# EAGLE design ScoreBoard-0.2 (EAGLE 9.5.1)
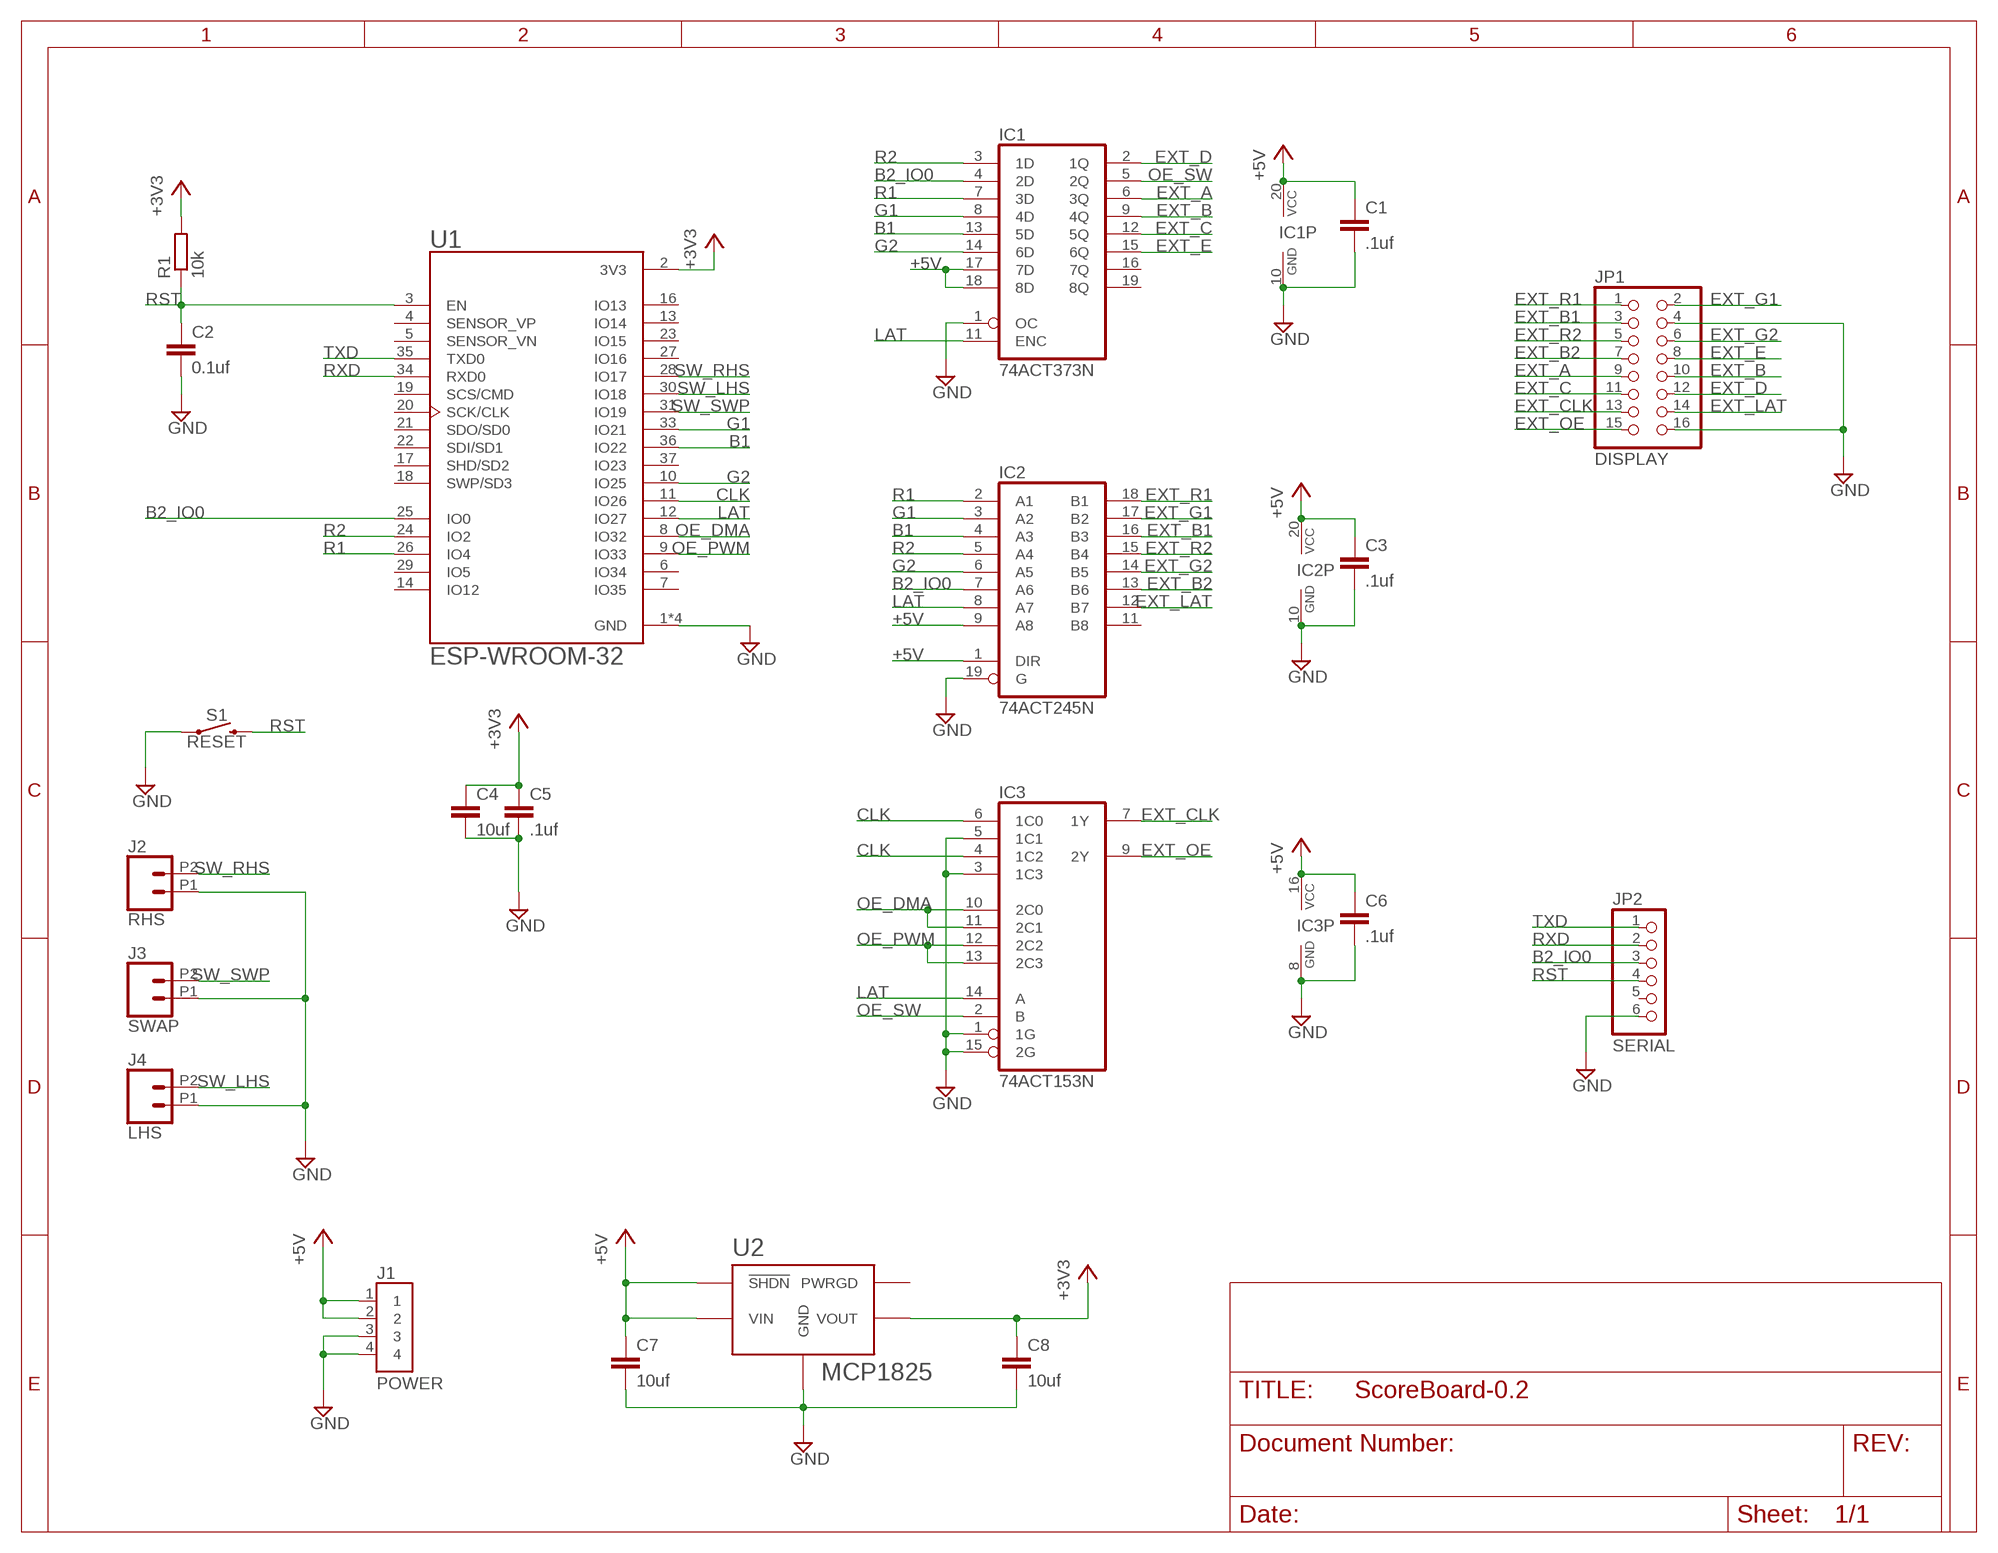
[diagram p0: schematic, sheet 1]

## Parts
C1  .1uf  C-EU025-025X050  [C025-025X050]
C2  0.1uf  C-EU025-025X050  [C025-025X050]
C3  .1uf  C-EU025-025X050  [C025-025X050]
C4  10uf  C-EU050-025X075  [C050-025X075]
C5  .1uf  C-EU025-025X050  [C025-025X050]
C6  .1uf  C-EU025-025X050  [C025-025X050]
C7  10uf  C-EU050-025X075  [C050-025X075]
C8  10uf  C-EU050-025X075  [C050-025X075]
IC1  74ACT373N  [DIL20]
IC2  74ACT245N  [DIL20]
IC3  74ACT153N  [DIL16]
J1  POWER  1-1123723-4  [TE_1-1123723-4]
J2  RHS  CONN_022.54MM_SCREWTERM  [1X02_2.54_SCREWTERM]
J3  SWAP  CONN_022.54MM_SCREWTERM  [1X02_2.54_SCREWTERM]
J4  LHS  CONN_022.54MM_SCREWTERM  [1X02_2.54_SCREWTERM]
JP1  DISPLAY  PINHD-2X8  [2X08]
JP2  SERIAL  PINHD-1X6/90  [1X06/90]
R1  10k  R-EU_0204/7  [0204/7]
S1  RESET  MOMENTARY-SWITCH-SPST-PTH-6.0MM  [TACTILE_SWITCH_PTH_6.0MM]
U1  ESP-WROOM-32  [MODULE_ESP-WROOM-32]
U2  MCP1825  MCP1825/DC  [SOT-223-5]

## Nets
+3V3 [power]: C4.1 C5.1 C8.1 R1.2 U1.2(3V3) U2.P$4(VOUT)
+5V [power]: C1.1 C3.1 C6.1 C7.1 IC1.17(7D) IC1.18(8D) IC1.20(VCC) IC2.1(DIR) IC2.9(A8) IC2.20(VCC) IC3.16(VCC) J1.1 J1.2 U2.P$1(!SHDN) U2.P$2(VIN)
B1: IC1.13(5D) IC2.4(A3) U1.36(IO22)
B2_IO0: IC1.4(2D) IC2.7(A6) JP2.3 U1.25(IO0)
CLK: IC3.4(1C2) IC3.6(1C0) U1.11(IO26)
EXT_A: IC1.6(3Q) JP1.9
EXT_B: IC1.9(4Q) JP1.10
EXT_B1: IC2.16(B3) JP1.3
EXT_B2: IC2.13(B6) JP1.7
EXT_C: IC1.12(5Q) JP1.11
EXT_CLK: IC3.7(1Y) JP1.13
EXT_D: IC1.2(1Q) JP1.12
EXT_E: IC1.15(6Q) JP1.8
EXT_G1: IC2.17(B2) JP1.2
EXT_G2: IC2.14(B5) JP1.6
EXT_LAT: IC2.12(B7) JP1.14
EXT_OE: IC3.9(2Y) JP1.15
EXT_R1: IC2.18(B1) JP1.1
EXT_R2: IC2.15(B4) JP1.5
G1: IC1.8(4D) IC2.3(A2) U1.33(IO21)
G2: IC1.14(6D) IC2.6(A5) U1.10(IO25)
GND [power]: C1.2 C2.2 C3.2 C4.2 C5.2 C6.2 C7.2 C8.2 IC1.1(OC) IC1.10(GND) IC2.10(GND) IC2.19(G) IC3.1(1G) IC3.3(1C3) IC3.5(1C1) IC3.8(GND) IC3.15(2G) J1.3 J1.4 J2.P1 J3.P1 J4.P1 JP1.4 JP1.16 JP2.6 S1.1 U1.1(GND) U1.1.1(GND) U1.15(GND) U1.38(GND) U2.P$3(GND) U2.P$6(GND)
LAT: IC1.11(ENC) IC2.8(A7) IC3.14(A) U1.12(IO27)
OE_DMA: IC3.10(2C0) IC3.11(2C1) U1.8(IO32)
OE_PWM: IC3.12(2C2) IC3.13(2C3) U1.9(IO33)
OE_SW: IC1.5(2Q) IC3.2(B)
R1: IC1.7(3D) IC2.2(A1) U1.26(IO4)
R2: IC1.3(1D) IC2.5(A4) U1.24(IO2)
RST: C2.1 JP2.4 R1.1 S1.3 U1.3(EN)
RXD: JP2.2 U1.34(RXD0)
SW_LHS: J4.P2 U1.30(IO18)
SW_RHS: J2.P2 U1.28(IO17)
SW_SWP: J3.P2 U1.31(IO19)
TXD: JP2.1 U1.35(TXD0)
Unconnected: IC1.16(7Q) IC1.19(8Q) IC2.11(B8) JP2.5 U1.4(SENSOR_VP) U1.5(SENSOR_VN) U1.6(IO34) U1.7(IO35) U1.13(IO14) U1.14(IO12) U1.16(IO13) U1.17(SHD/SD2) U1.18(SWP/SD3) U1.19(SCS/CMD) U1.20(SCK/CLK) U1.21(SDO/SD0) U1.22(SDI/SD1) U1.23(IO15) U1.27(IO16) U1.29(IO5) U1.37(IO23) U2.P$5(PWRGD)

## Library data of the parts
C1-C8 = rcl:C-EU: CAPACITOR, European symbol; SPICEPREFIX: C
IC1 = 74xx-eu:74*373: Octal D type transparent LATCH, edge triggered
IC2 = 74xx-eu:74*245: Octal BUS TRANSCEIVER, 3-state
IC3 = 74xx-eu:74*153: Dual 4-line to 1-line data SELECTOR/MULTIPLEXER
J1 = 1-1123723-4:1-1123723-4: Conn Wire to Board HDR 4 POS 3.96mm Solder ST Thru-Hole Automotive Bag; CENTERLINE_PITCH: 3.96 mm[.156 in]; COMMENT: 1-1123723-4; DESCRIPTION: 3.96 EP HDR ASSY 4P_NATURAL_; DIGI-KEY_PART_NUMBER: A106863-ND; DIGI-KEY_PURCHASE_URL: https://www.digikey.com/product-detail/en/te-connectivity-amp-connectors/1-1123723-4/A106863-ND/686927?utm_source=snapeda&utm_medium=aggregator&utm_campaign=symbol; EU_ROHS_COMPLIANCE: Compliant; MF: TE Connectivity; MP: 1-1123723-4; NUMBER_OF_POSITIONS: 4; PACKAGE: None; PRODUCT_TYPE: Header; TE_PURCHASE_URL: https://www.te.com/usa-en/product-1-1123723-4.html?te_bu=Cor&te_type=disp&te_campaign=seda_glo_cor-seda-global-disp-prtnr-fy19-seda-model-bom-cta_sma-317_1&elqCampaignId=32493
J2-J4 = SparkFun-Connectors:CONN_02: Multi connection point. Often used as Generic Header-pin footprint for 0.1 inch spaced/style header connections On any of the 0.1 inch spaced packages, you can populate with these: Break Away Headers - Straight <https://www.sparkfun.com/products/116> (PRT-00116) Break Away Male Headers - Right Angle <https://www.sparkfun.com/products/553> (PRT-00553) Female Headers <https://www.sparkfun.com/products/115> (PRT-00115) Break Away Headers - Machine Pin <https://www.sparkfun.com/products/117> (PRT-00117) Break Away Female Headers - Swiss Machine Pin <https://www.sparkfun.com/products/743> (PRT-00743) For SCREWTERMINALS and SPRING TERMINALS visit here: Screw Terimnals on SparkFun.com <https://www.sparkfun.com/search/results?term=Screw+Terminals> (5mm/3.5mm/2.54mm spacing) This device is also useful as a general connection point to wire up your design to another part of your project. Our various solder wires solder well into these plated through hole pads. Hook-Up Wire - Assortment (Stranded, 22 AWG) <https://www.sparkfun.com/products/11375> (PRT-11375) Hook-Up Wire - Assortment (Solid Core, 22 AWG) <https://www.sparkfun.com/products/11367> (PRT-11367) View the entire wire category on our website here <https://www.sparkfun.com/categories/141> Special notes: Molex polarized connector foot print use with: PRT-08233 with associated crimp pins and housings. 2.54_SCREWTERM for use with PRT-10571. 3.5mm Screw Terminal footprints for PRT-08084 5mm Screw Terminal footprints for use with PRT-08432
JP1 = pinhead:PINHD-2X8: PIN HEADER
JP2 = pinhead:PINHD-1X6: PIN HEADER
R1 = rcl:R-EU_: RESISTOR, European symbol; SPICEPREFIX: R
S1 = SparkFun-Switches:MOMENTARY-SWITCH-SPST: Momentary Switch (Pushbutton) - SPST Normally-open (NO) SPST momentary switches (buttons, pushbuttons). Variants PTH-12MM - 12mm square, through-hole Momentary Pushbutton Switch - 12mm Square <https://www.sparkfun.com/products/9190> (COM-09190) PTH-6.0MM, PTH-6.0MM-KIT - 6.0mm square, through-hole Mini Pushbutton Switch <https://www.sparkfun.com/products/97> (COM-00097) KIT package intended for soldering kit's - only one side of pads' copper is exposed. PTH-RIGHT-ANGLE-KIT - Right-angle, through-hole Right Angle Tactile Button <https://www.sparkfun.com/products/10791> - Used on SparkFun BigTime Watch Kit <https://www.sparkfun.com/products/11734> SMD-12MM - 12mm square, surface-mount Tactile Button - SMD (12mm) <https://www.sparkfun.com/products/12993> (COM-12993) Used on SparkFun PicoBoard <https://www.sparkfun.com/products/11888> SMD-4.5MM - 4.5mm Square Trackball Switch Used on SparkFun Blackberry Trackballer Breakout <https://www.sparkfun.com/products/13169> SMD-4.6MMX2.8MM - 4.60mm x 2.80mm, surface mount Used on SparkFun SAMD21 Mini Breakout <https://www.sparkfun.com/products/13664> SMD-5.2MM, SMD-5.2-REDUNDANT - 5.2mm square, surface-mount Mini Pushbutton Switch - SMD <https://www.sparkfun.com/products/8720> (COM-08720) Used on Arduino Pro Mini <https://www.sparkfun.com/products/11114> REDUNDANT package connects both switch circuits together SMD-6.0X3.5MM - 6.0 x 3.5mm, surface mount Momentary Reset Switch SMD <https://www.sparkfun.com/products/8229> (COM-08229) SMD-6.2MM-TALL - 6.2mm square, surface mount Tactile Button - SMD (6mm) <https://www.sparkfun.com/products/12992> Used on SparkFun Digital Sandbox <https://www.sparkfun.com/products/12651> SMD-RIGHT-ANGLE - Right-angle, surface mount Used on SparkFun Block for Intel® Edison - Arduino <https://www.sparkfun.com/products/13036>; PROD_ID: SWCH-08441; SF_SKU: COM-00097
U1 = ESP-WROOM-32:ESP-WROOM-32: Module: combo; GPIO, I2C x2, I2S x2, SDIO, SPI x3, UART x3; 19.5dBm; DESCRIPTION: Module: combo; GPIO, I2C x2, I2S x2, SDIO, SPI x3, UART x3; 19.5dBm; DIGI-KEY_PART_NUMBER: 1188-1178-ND; DIGI-KEY_PURCHASE_URL: https://www.digikey.com/product-detail/en/olimex-ltd/ESP-WROOM-32/1188-1178-ND/6580750?utm_source=snapeda&utm_medium=aggregator&utm_campaign=symbol; MF: Olimex LTD; MP: ESP-WROOM-32; PACKAGE: Module Espressif Systems
U2 = voltagereg:MCP1825/DC

## Net classes
1 power: width 0.635 mm, clearance 0.254 mm to class 0, clearance 0.254 mm

## Board
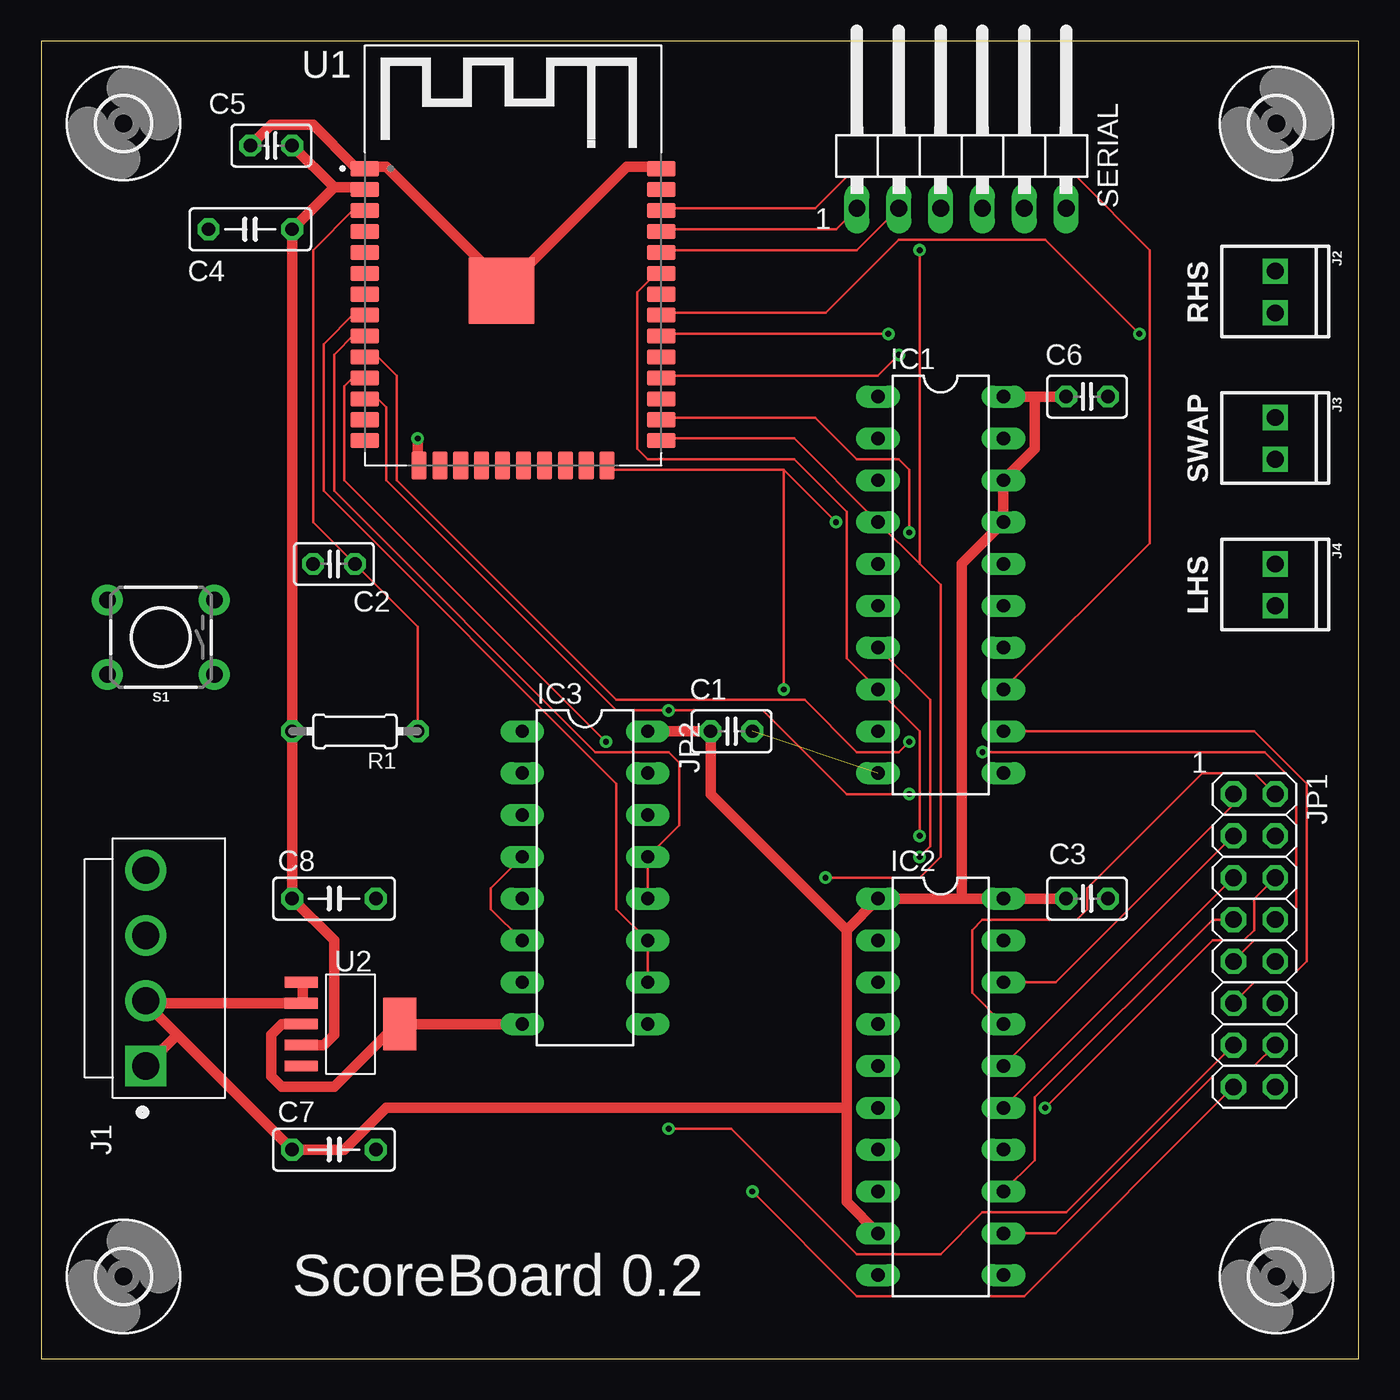
[diagram p1: board, top side]
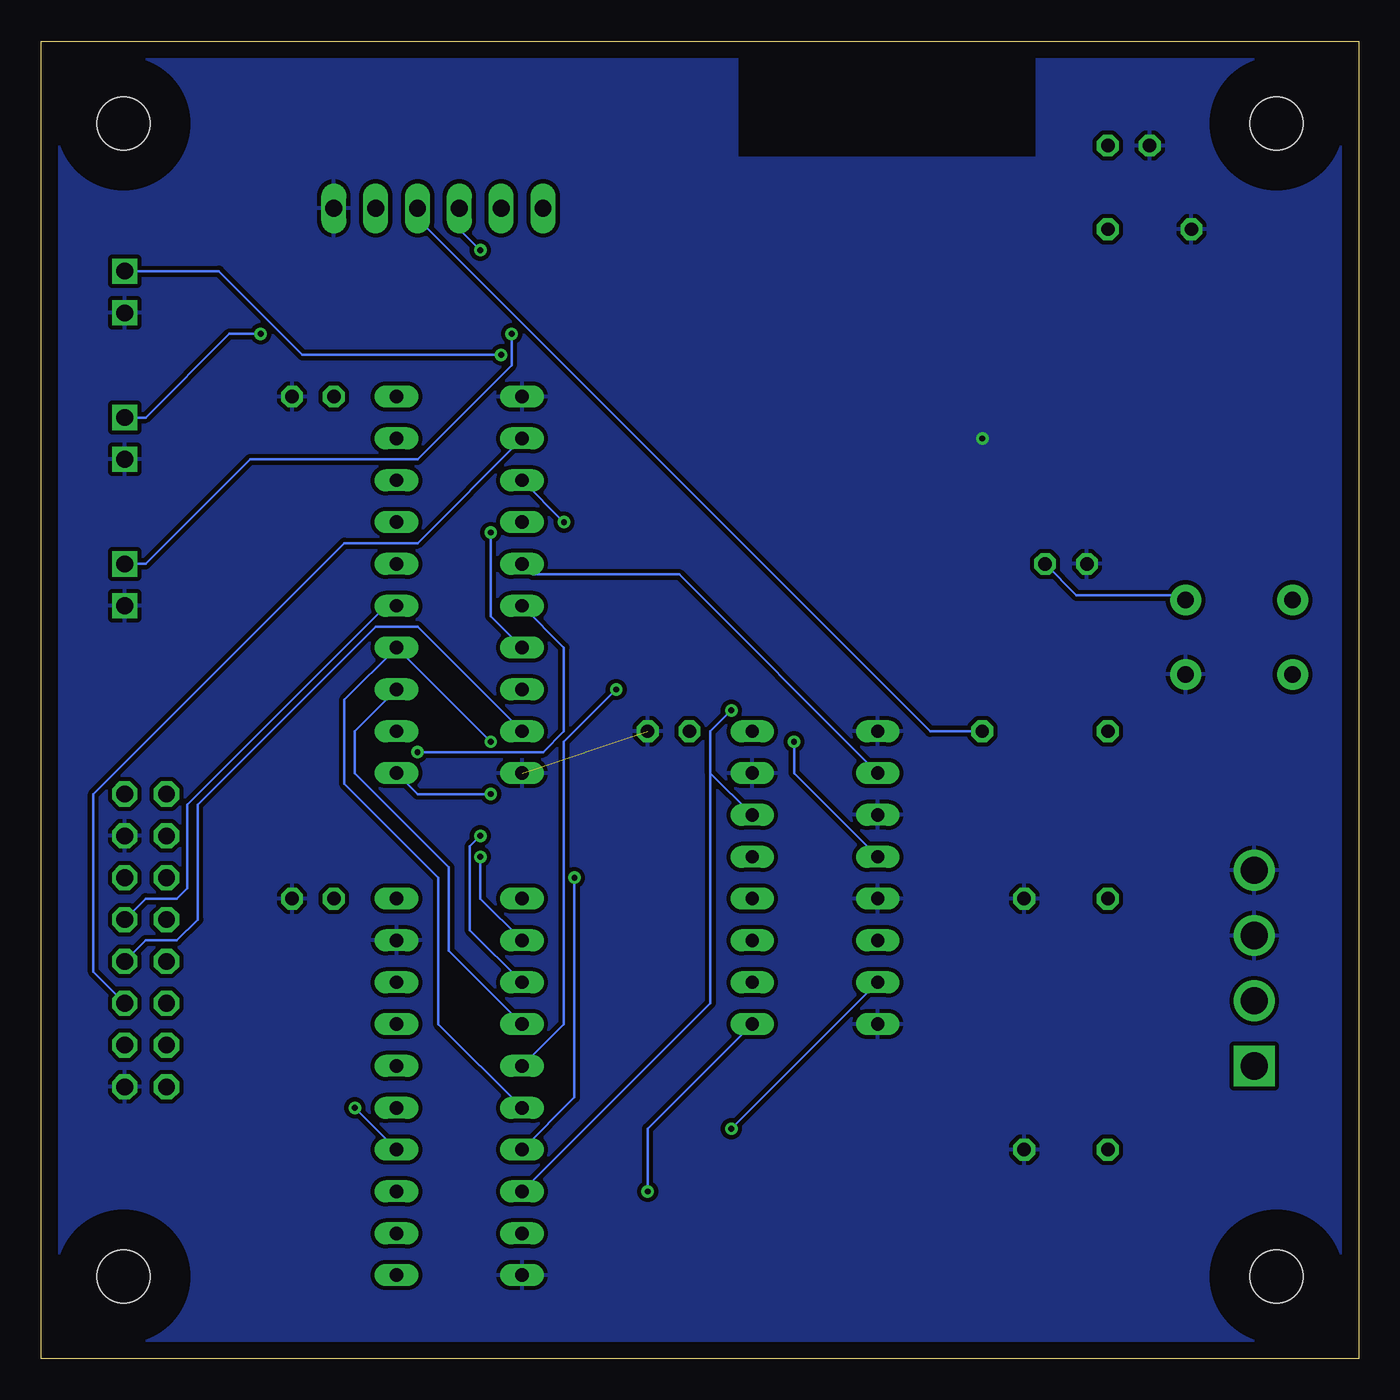
[diagram p2: board, bottom side, seen from below]

Size 80 x 80 mm. Coordinates in mm from the lower left corner, seen from the top.
Outline: 0,0 80,0 80,80 0,80 0,0
Copper layers (1*16): Top 0.035mm / dielectric 0.15mm / Bottom 0.035mm
Design rules "default": minimum track width 6mil, minimum drill 0.35mm, track to track 6mil, track to pad 6mil, pad to pad 6mil, via to via 6mil, smd to smd 6mil, copper to edge 40mil, drill to drill 6mil, minimum pad ring 10mil, minimum via ring 8mil, stop-mask expansion 4mil, vias tented up to drill 0mil, thermal gap 10mil

### Footprints (pad centres in the part's own frame; a part is rotated, then mirrored left to right if it is on the bottom)
C025-025X050 = drill 0.813 octagon: 1 -1.27,0; 2 1.27,0
C050-025X075 = drill 0.813 octagon: 1 -2.54,0; 2 2.54,0
DIL20 = drill 0.813 long: 1 -11.43,-3.81; 2 -8.89,-3.81; 3 -6.35,-3.81; 4 -3.81,-3.81; 5 -1.27,-3.81; 6 1.27,-3.81; 7 3.81,-3.81; 8 6.35,-3.81; 9 8.89,-3.81; 10 11.43,-3.81; 11 11.43,3.81; 12 8.89,3.81; 13 6.35,3.81; 14 3.81,3.81; 15 1.27,3.81; 16 -1.27,3.81; 17 -3.81,3.81; 18 -6.35,3.81; 19 -8.89,3.81; 20 -11.43,3.81
DIL16 = drill 0.813 long: 1 -8.89,-3.81; 2 -6.35,-3.81; 3 -3.81,-3.81; 4 -1.27,-3.81; 5 1.27,-3.81; 6 3.81,-3.81; 7 6.35,-3.81; 8 8.89,-3.81; 9 8.89,3.81; 10 6.35,3.81; 11 3.81,3.81; 12 1.27,3.81; 13 -1.27,3.81; 14 -3.81,3.81; 15 -6.35,3.81; 16 -8.89,3.81
TE_1-1123723-4 = drill 1.65 square: 1 0,0 | drill 1.65: 2 3.96,0; 3 7.92,0; 4 11.88,0
1X02_2.54_SCREWTERM = drill 1.016 square: P1 2.54,0; P2 0,0
2X08 = drill 1.016 octagon: 1 -8.89,-1.27; 2 -8.89,1.27; 3 -6.35,-1.27; 4 -6.35,1.27; 5 -3.81,-1.27; 6 -3.81,1.27; 7 -1.27,-1.27; 8 -1.27,1.27; 9 1.27,-1.27; 10 1.27,1.27; 11 3.81,-1.27; 12 3.81,1.27; 13 6.35,-1.27; 14 6.35,1.27; 15 8.89,-1.27; 16 8.89,1.27
1X06/90 = drill 1.016 long: 1 -6.35,-3.81; 2 -3.81,-3.81; 3 -1.27,-3.81; 4 1.27,-3.81; 5 3.81,-3.81; 6 6.35,-3.81
0204/7 = drill 0.813 octagon: 1 -3.81,0; 2 3.81,0
TACTILE_SWITCH_PTH_6.0MM = drill 1.016 pad 1.88: 1 -3.251,2.261; 2 3.251,2.261; 3 -3.251,-2.261; 4 3.251,-2.261
MODULE_ESP-WROOM-32 = smd 1.7 x 0.9: 1 -9,8.255; 2 -9,6.985; 3 -9,5.715; 4 -9,4.445; 5 -9,3.175; 6 -9,1.905; 7 -9,0.635; 8 -9,-0.635; 9 -9,-1.905; 10 -9,-3.175; 11 -9,-4.445; 12 -9,-5.715; 13 -9,-6.985; 14 -9,-8.255; 25 9,-8.255; 26 9,-6.985; 27 9,-5.715; 28 9,-4.445; 29 9,-3.175; 30 9,-1.905; 31 9,-0.635; 32 9,0.635; 33 9,1.905; 34 9,3.175; 35 9,4.445; 36 9,5.715; 37 9,6.985; 38 9,8.255 | smd 4 x 4: 1.1 -0.7,0.845 | smd 0.9 x 1.7: 15 -5.715,-9.755; 16 -4.445,-9.755; 17 -3.175,-9.755; 18 -1.905,-9.755; 19 -0.635,-9.755; 20 0.635,-9.755; 21 1.905,-9.755; 22 3.175,-9.755; 23 4.445,-9.755; 24 5.715,-9.755
SOT-223-5 = smd 0.65 x 2: P$1 -2.54,-2; P$2 -1.27,-2; P$3 0,-2; P$4 1.27,-2; P$5 2.54,-2 | smd 3.2 x 2: P$6 0,4
3,2 = hole 3.2: 0,0

### Placement (x,y rotation side)
C1  41.91,38.1 0 top
C2  17.78,48.26 180 top
C3  63.5,27.94 0 top
C4  12.7,68.58 180 top
C5  13.97,73.66 180 top
C6  63.5,58.42 0 top
C7  17.78,12.7 0 top
C8  17.78,27.94 0 top
IC1  54.61,46.99 270 top
IC2  54.61,16.51 270 top
IC3  33.02,29.21 270 top
J1  6.35,17.78 90 top
J2  74.93,66.04 270 top
J3  74.93,57.15 270 top
J4  74.93,48.26 270 top
JP1  73.66,25.4 270 top
JP2  55.88,73.66 0 top
R1  19.05,38.1 180 top
S1  7.27,43.81 180 top
U1  28.65,64 0 top
U2  17.78,20.32 270 top
U$1  [3,2]  5,75 0 top
U$2  [3,2]  5,5 0 top
U$3  [3,2]  75,5 0 top
U$4  [3,2]  75,75 0 top

### Tracks (layer width: path | path; a pad name or v marks a point on that pad's centre or on a via)
+3V3
  Top 0.635: 17.78,71.12 19.05,71.12 U1.2 | C5.1 17.78,71.12 | 17.78,71.12 C4.1 R1.2 C8.1 17.78,25.4 17.78,19.68 17.14,19.05 U2.P$4
+5V
  Top 0.635: U2.P$1 15.88,22.86 15.88,21.59 U2.P$2 6.35,21.59 | 6.35,21.59 8.26,19.68 | 8.26,19.68 C7.1 18.41,12.7 20.95,15.24 48.9,15.24 | 6.35,21.59 J1.2 | 8.26,19.68 J1.1 | C6.1 60.33,58.42 | 60.33,58.42 IC1.20 | 60.33,58.42 60.33,55.24 IC1.18 IC1.17 55.88,48.26 55.88,27.94 | C3.1 IC2.20 55.88,27.94 | IC3.16 C1.1 40.64,34.29 48.9,26.04 | IC2.9 48.9,9.53 48.9,15.24 | 48.9,26.04 48.9,15.24 | 48.9,26.04 IC2.1 55.88,27.94
B1
  Top 0.152: IC1.13 67.31,49.53 67.31,67.31 62.87,71.75 48.9,71.75 46.99,69.85 38.1,69.85 U1.36
  Bottom 0.152: IC2.4 55.24,24.77 55.24,29.84 60.96,35.56 60.96,38.1 IC1.13
B2_IO0  (via drill 0.35)
  Top 0.152: U1.25 38.1,55.88 45.72,55.88 IC1.4 53.34,48.26 | v47.62,29.21 53.34,29.21 54.61,30.48 54.61,46.99 53.34,48.26 | 53.34,48.26 v53.34,67.31
  Bottom 0.152: IC2.7 47.62,15.88 v47.62,29.21 | JP2.3 54.61,68.58 v53.34,67.31
CLK  (via drill 0.35)
  Top 0.152: v34.29,37.47 18.41,53.34 18.41,59.05 19.05,59.69 U1.11 | IC3.6 27.3,27.3 27.3,28.57 IC3.4
  Bottom 0.152: v34.29,37.47 34.29,35.56 IC3.4
EXT_A  (via drill 0.35)
  Top 0.152: v57.15,36.83 74.3,36.83 76.2,34.92 76.2,26.04 75.56,25.4 73.66,25.4 JP1.9
  Bottom 0.152: IC1.6 48.26,43.18 48.26,38.1 49.53,36.83 v57.15,36.83
EXT_B
  Bottom 0.152: IC1.9 57.15,44.45 59.69,44.45 70.48,33.66 70.48,26.67 71.75,25.4 73.66,25.4 JP1.10
EXT_B1
  Top 0.152: JP1.3 IC2.16
EXT_B2
  Top 0.152: IC2.13 60.33,12.06 60.33,15.88 71.12,26.67 JP1.7
EXT_C
  Top 0.152: IC1.12 73.66,38.1 76.83,34.92 76.83,24.13 75.56,22.86 73.66,22.86 JP1.11
EXT_CLK  (via drill 0.35)
  Top 0.152: v38.1,13.97 41.91,13.97 49.53,6.35 54.61,6.35 57.15,8.89 62.23,8.89 JP1.13
  Bottom 0.152: v38.1,13.97 IC3.7
EXT_D
  Bottom 0.152: IC1.2 57.15,49.53 61.59,49.53 76.83,34.29 76.83,23.5 JP1.12
EXT_E
  Bottom 0.152: IC1.15 59.05,45.72 71.12,33.66 71.12,28.57 71.75,27.94 73.66,27.94 JP1.8
EXT_G1
  Top 0.152: IC2.17 56.52,22.23 56.52,26.04 57.15,26.67 62.87,26.67 63.5,27.3 63.5,28.57 70.48,35.56 73.66,35.56 JP1.2
EXT_G2  (via drill 0.35)
  Top 0.152: v60.96,15.24 71.12,25.4 73.03,25.4 73.66,26.04 73.66,27.94 JP1.6
  Bottom 0.152: v60.96,15.24 IC2.14
EXT_LAT
  Top 0.152: IC2.12 61.59,7.62 71.75,17.78 73.66,17.78 JP1.14
EXT_OE  (via drill 0.35)
  Top 0.152: v43.18,10.16 49.53,3.81 59.69,3.81 JP1.15
  Bottom 0.152: IC3.9 43.18,13.97 v43.18,10.16
EXT_R1
  Top 0.152: IC2.18 61.59,22.86 72.39,33.66 JP1.1
EXT_R2
  Top 0.152: JP1.5 IC2.15
G1  (via drill 0.35)
  Top 0.152: U1.33 37.47,66.04 36.2,64.77 36.2,55.24 36.83,54.61 45.72,54.61 48.9,51.44 48.9,42.55 IC1.8 53.34,38.1 v53.34,31.75
  Bottom 0.152: IC2.3 53.98,26.04 53.98,31.11 v53.34,31.75
G2  (via drill 0.35)
  Top 0.152: v52.7,37.47 52.07,36.83 49.53,36.83 46.35,40.01 34.92,40.01 21.59,53.34 21.59,59.69 20.32,60.96 19.68,60.96 U1.10
  Bottom 0.152: v52.7,37.47 IC1.14 61.59,40.01 61.59,34.92 55.88,29.21 55.88,20.32 IC2.6
GND  (via drill 0.35)  (1 unrouted)
  Top 0.635: U1.38 37.47,72.39 35.56,72.39 28.57,65.41 U1.1.1 27.94,65.41 20.95,72.39 19.68,72.39 U1.1 19.05,72.39 16.51,74.93 13.97,74.93 C5.2 | U2.P$3 14.61,20.32 13.97,19.68 13.97,17.14 14.61,16.51 17.78,16.51 21.59,20.32 U2.P$6 IC3.8 | v22.86,55.88 22.86,54.61 U1.15
  pour Bottom: 0,80 80,80 80,0 0,0
LAT  (via drill 0.35)
  Top 0.152: U1.12 19.68,58.42 20.32,58.42 20.95,57.78 20.95,53.34 34.92,39.37 v38.1,39.37 43.81,39.37 48.9,34.29 v52.7,34.29
  Bottom 0.152: v38.1,39.37 39.37,38.1 39.37,35.56 | IC3.14 39.37,35.56 | IC2.8 39.37,21.59 39.37,35.56 | IC1.11 57.15,34.29 v52.7,34.29
OE_DMA
  Top 0.152: U1.8 19.05,63.5 17.14,61.59 17.14,52.7 34.92,34.92 34.92,27.3 IC3.11 IC3.10
OE_PWM
  Top 0.152: U1.9 19.05,62.23 17.78,60.96 17.78,52.7 33.66,36.83 38.1,36.83 38.73,36.2 38.73,32.38 IC3.13 IC3.12
OE_SW
  Bottom 0.152: IC3.2 41.27,47.62 50.16,47.62 IC1.5
R1  (via drill 0.35)
  Top 0.152: v52.7,50.16 52.7,53.98 52.07,54.61 49.53,54.61 46.99,57.15 38.1,57.15 U1.26 | v53.34,30.48 53.98,31.11 53.98,40.01 IC1.7
  Bottom 0.152: v52.7,50.16 52.7,45.09 IC1.7 | IC2.2 53.34,27.94 v53.34,30.48
R2  (via drill 0.35)
  Top 0.152: 45.09,53.98 34.29,53.98 U1.24 | v48.26,50.8 45.09,53.98 | 45.09,53.98 v45.09,40.64
  Bottom 0.152: IC1.3 v48.26,50.8 | IC2.5 48.26,20.32 48.26,37.47 v45.09,40.64
RST
  Top 0.152: U1.3 19.05,69.85 16.51,67.31 16.51,50.8 C2.1 22.86,44.45 R1.1
  Bottom 0.152: JP2.4 57.15,69.22 26.04,38.1 R1.1 | C2.1 17.14,46.35 10.79,46.35 S1.3
RXD
  Top 0.152: JP2.2 49.53,67.31 38.1,67.31 U1.34
SW_LHS  (via drill 0.35)
  Top 0.152: v51.44,62.23 38.1,62.23 U1.30
  Bottom 0.152: v51.44,62.23 51.44,60.33 57.15,54.61 67.31,54.61 73.66,48.26 J4.P2
SW_RHS  (via drill 0.35)
  Top 0.152: v52.07,60.96 50.8,59.69 38.1,59.69 U1.28
  Bottom 0.152: v52.07,60.96 64.14,60.96 69.22,66.04 J2.P2
SW_SWP  (via drill 0.35)
  Top 0.152: v66.67,62.23 60.96,67.94 52.07,67.94 47.62,63.5 38.1,63.5 U1.31
  Bottom 0.152: v66.67,62.23 68.58,62.23 73.66,57.15 J3.P2
TXD
  Top 0.152: JP2.1 48.26,68.58 38.1,68.58 U1.35

### Text on the board
tNames: 1 | 1 | ScoreBoard 0.2